# EAGLE design PCB-REMCON-E (EAGLE 7.1.0)
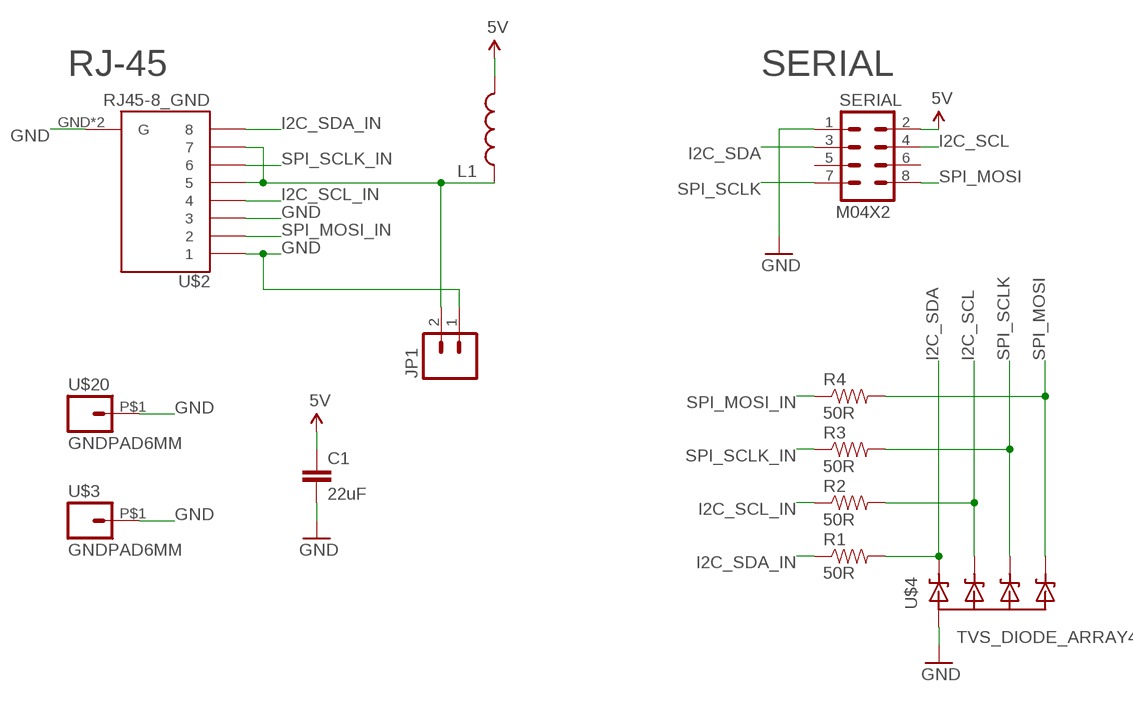
[diagram p0: schematic, sheet 1]

## Parts
C1  22uF  CAP0805  [0805]
JP1  M02PTH  [1X02]
L1  INDUCTOR0805  [0805]
R1  50R  RESISTOR0603-RES  [0603-RES]
R2  50R  RESISTOR0603-RES  [0603-RES]
R3  50R  RESISTOR0603-RES  [0603-RES]
R4  50R  RESISTOR0603-RES  [0603-RES]
SERIAL  M04X2  [2X4]
U$2  RJ45-8_GND  [RJ45-8_GND]
U$3  GNDPAD6MM  [3.2MMPAD6MM]
U$4  TVS_DIODE_ARRAY4  [SOT23-6L]
U$20  GNDPAD6MM  [3.2MMPAD6MM]

## Nets
5V [Power]: C1.1 L1.2 SERIAL.2
GND [Power]: C1.2 JP1.1 SERIAL.1 U$2.1 U$2.3 U$2.GND1(G) U$2.GND(G) U$3.P$1 U$4.2(GND) U$4.5(GND) U$20.P$1
I2C_SCL: R2.2 SERIAL.4 U$4.3(B)
I2C_SCL_IN: R2.1 U$2.4
I2C_SDA: R1.2 SERIAL.3 U$4.1(A)
I2C_SDA_IN: R1.1 U$2.8
N$1 [Power]: JP1.2 L1.1 U$2.5 U$2.7
SPI_MOSI: R4.2 SERIAL.8 U$4.6(D)
SPI_MOSI_IN: R4.1 U$2.2
SPI_SCLK: R3.2 SERIAL.7 U$4.4(C)
SPI_SCLK_IN: R3.1 U$2.6
Unconnected: SERIAL.5 SERIAL.6

## Notes on the sheet
- RJ-45 | SERIAL

## Library data of the parts
C1 = SparkFun:CAP: Capacitor Standard 0603 ceramic capacitor, and 0.1" leaded capacitor.
JP1 = SparkFun:M02: Header 2 Standard 2-pin 0.1" header. Use with straight break away headers (SKU : PRT-00116), right angle break away headers (PRT-00553), swiss pins (PRT-00743), machine pins (PRT-00117), and female headers (PRT-00115). Molex polarized connector foot print use with SKU : PRT-08233 with associated crimp pins and housings.
L1 = SparkFun:INDUCTOR: Inductors Basic Inductor/Choke - 0603 and 1206. Footprints are not proven and vary greatly between part numbers.
R1-R4 = SparkFun:RESISTOR: Resistor Basic schematic elements and footprints for 0603, 1206, and PTH resistors.
SERIAL = SparkFun:M04X2
U$2 = SKAARHOJ:RJ45-8_GND
U$3 U$20 = SKAARHOJ:GNDPAD
U$4 = SKAARHOJ:TVS_DIODE_ARRAY4

## Net classes
0 default: width 0.203 mm, drill 0.406 mm, clearance 0.203 mm
1 Power: width 0.406 mm, drill 0.61 mm, clearance 0.203 mm

## Board
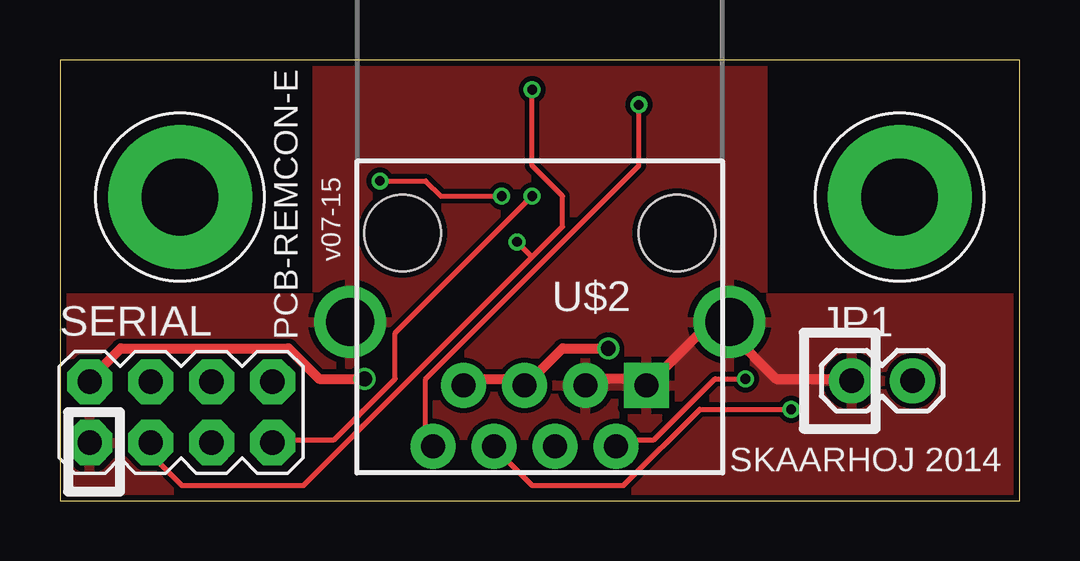
[diagram p1: board, top side]
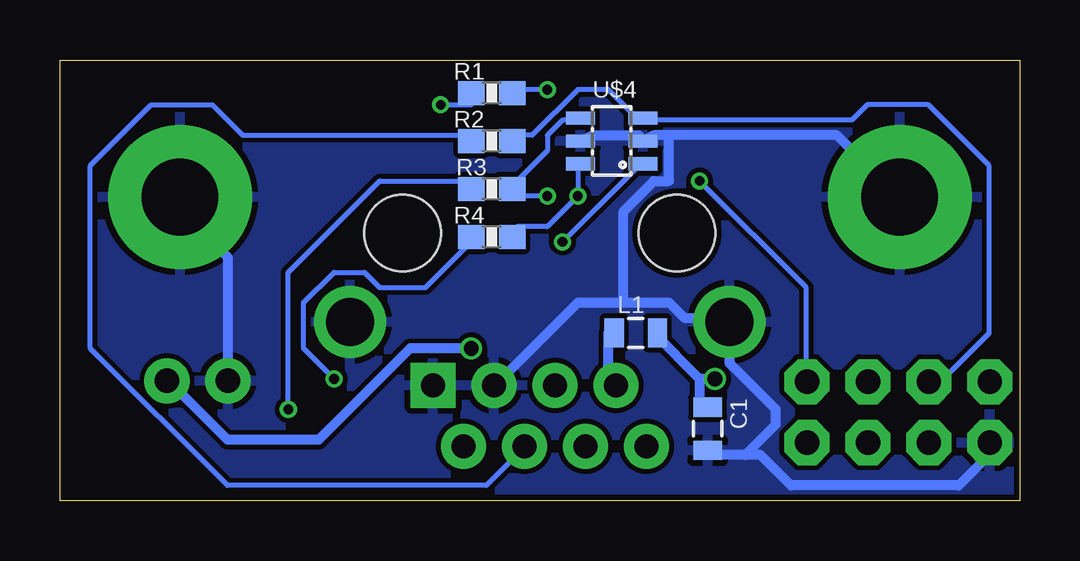
[diagram p2: board, bottom side, seen from below]

Size 40 x 18.38 mm. Coordinates in mm from the lower left corner, seen from the top.
Outline: 0,18.38 0,0 40,0 40,18.38 0,18.38
Copper layers (1*16): Top 0.035mm / dielectric 1.5mm / Bottom 0.035mm
Design rules "Fusion_eagle_rule_v1.1": minimum track width 6mil, minimum drill 12mil, track to track 6mil, track to pad 6mil, pad to pad 6mil, via to via 6mil, smd to smd 0mil, copper to edge 10mil, drill to drill 10mil, minimum pad ring 10mil, minimum via ring 6mil, stop-mask expansion 2mil, vias tented up to drill 100mil, thermal gap 10mil
tRestrict: area 29.5,8.7 to 40,19.2; area 0,8.7 to 10.5,19.2

### Footprints (pad centres in the part's own frame; a part is rotated, then mirrored left to right if it is on the bottom)
0805 = smd 0.8 x 1.2: 1 -0.9,0; 2 0.9,0
1X02 = drill 1.016 pad 1.88: 1 0,0; 2 2.54,0
0603-RES = smd 1.1 x 1: 1 -0.85,0; 2 0.85,0
2X4 = drill 1.016 pad 1.88 octagon: 1 -3.81,-1.27; 2 -3.81,1.27; 3 -1.27,-1.27; 4 -1.27,1.27; 5 1.27,-1.27; 6 1.27,1.27; 7 3.81,-1.27; 8 3.81,1.27
RJ45-8_GND = drill 1 pad 1.88 square: 1 -4.445,6.35 | drill 1 pad 1.88: 2 -3.175,8.89; 3 -1.905,6.35; 4 -0.635,8.89; 5 0.635,6.35; 6 1.905,8.89; 7 3.175,6.35; 8 4.445,8.89 | drill 2: GND -7.9,3.7; GND1 7.9,3.7 | hole 3.2: -5.715,0; 5.715,0
3.2MMPAD6MM = drill 3.2 pad 6: P$1 0,0
SOT23-6L = smd 0.55 x 1.2: 1 -0.95,-1.3; 2 0,-1.3; 3 0.95,-1.3; 4 0.95,1.3; 5 0,1.3; 6 -0.95,1.3

### Placement (x,y rotation side)
C1  13,3 270 bottom
JP1  33,5 0 top
L1  16,7 0 bottom
R1  22,17 0 bottom
R2  22,15 0 bottom
R3  22,13 0 bottom
R4  22,11 0 bottom
SERIAL  5.05,3.69 0 top
U$2  20,11.16 180 top
U$3  35,12.66 0 top
U$4  17,15 90 bottom
U$20  5,12.66 0 top

### Tracks (layer width: path | path; a pad name or v marks a point on that pad's centre or on a via)
5V  (via drill 0.61)
  Top 0.406: v12.7,5.08 10.79,5.08 9.53,6.35 2.54,6.35 1.27,5.08 SERIAL.2
  Bottom 0.406: 13.34,5.08 13.34,3.81 C1.1 | 13.34,5.08 15.24,6.99 L1.2 | v12.7,5.08 13.34,5.08
GND
  Top 0.406: U$2.3 22.23,5.08 24.13,5.08 U$2.1 24.77,5.08 27.3,7.62 U$2.GND 27.94,6.99 29.84,5.08 32.38,5.08 JP1.1
  Bottom 0.406: U$4.5 17.78,15.24 15.88,15.24 U$4.2 15.24,15.24 14.61,15.24 | 14.61,15.24 7.62,15.24 5.08,12.7 U$20.P$1 | 11.43,1.91 10.79,1.91 9.53,0.64 2.54,0.64 1.27,1.91 SERIAL.1 | 11.43,1.91 12.7,1.91 C1.2 | 11.43,1.91 10.16,3.17 10.16,3.81 12.06,5.71 12.06,6.99 U$2.GND1 12.7,7.62 13.97,7.62 14.61,8.26 16.51,8.26 | JP1.1 33.02,5.08 33.02,10.16 34.92,12.06 U$3.P$1 | 16.51,8.26 18.41,8.26 21.59,5.08 U$2.3 | 14.61,15.24 14.61,13.34 15.24,13.34 16.51,12.06 16.51,8.26
  pour Top: 0,0 40,0 40,19 0,19
  pour Bottom: 0,0 40,0 40,19 0,19
I2C_SCL
  Bottom 0.203: R2.2 20.95,15.24 20.32,15.24 18.41,17.14 17.14,17.14 15.88,15.88 U$4.3 15.24,15.88 6.99,15.88 6.35,16.51 3.81,16.51 1.27,13.97 1.27,6.99 3.17,5.08 SERIAL.4
I2C_SCL_IN
  Bottom 0.203: R2.1 22.86,15.24 32.38,15.24 33.66,16.51 36.2,16.51 38.73,13.97 38.73,6.35 33.02,0.64 22.23,0.64 20.95,1.91 U$2.4
I2C_SDA  (via drill 0.41)
  Top 0.203: v19.68,17.14 19.68,13.97 20.95,12.7 20.95,11.43 19.68,10.16 | 19.68,10.16 10.16,0.64 5.08,0.64 3.81,1.91 SERIAL.3 | 19.68,10.16 v19.05,10.79
  Bottom 0.203: v19.68,17.14 20.95,17.14 R1.2 | v19.05,10.79 15.88,13.97 U$4.1
I2C_SDA_IN  (via drill 0.41)
  Top 0.203: v24.13,16.51 24.13,13.97 15.24,5.08 15.24,2.54 U$2.8
  Bottom 0.203: v24.13,16.51 22.86,16.51 R1.1
N$1  (via drill 0.61)
  Top 0.406: U$2.7 17.14,5.08 19.05,5.08 U$2.5 19.68,5.08 20.95,6.35 v22.86,6.35
  Bottom 0.406: L1.1 17.14,6.99 17.14,5.08 U$2.7 | v22.86,6.35 25.4,6.35 29.21,2.54 33.02,2.54 34.92,4.45 JP1.2
SPI_MOSI  (via drill 0.41)
  Top 0.203: v18.41,12.7 15.88,12.7 15.24,13.34 v13.34,13.34
  Bottom 0.203: R4.2 20.95,11.43 19.68,11.43 v18.41,12.7 18.41,13.97 U$4.6 | v13.34,13.34 8.89,8.89 8.89,5.08 SERIAL.8
SPI_MOSI_IN  (via drill 0.41)
  Top 0.203: v28.57,5.08 27.3,5.08 24.77,2.54 23.5,2.54 U$2.2
  Bottom 0.203: v28.57,5.08 29.84,6.35 29.84,8.26 28.57,9.53 27.3,9.53 26.67,8.89 24.77,8.89 22.86,10.79 R4.1
SPI_SCLK  (via drill 0.41)
  Top 0.203: v19.68,12.7 13.97,6.99 13.97,5.08 11.43,2.54 8.89,2.54 SERIAL.7
  Bottom 0.203: U$4.4 18.41,15.88 19.05,15.88 19.68,15.24 19.68,14.61 20.95,13.34 R3.2 20.95,12.7 v19.68,12.7
SPI_SCLK_IN  (via drill 0.41)
  Top 0.203: v30.48,3.81 26.67,3.81 23.5,0.64 19.68,0.64 18.41,1.91 U$2.6
  Bottom 0.203: v30.48,3.81 30.48,9.53 26.67,13.34 22.86,13.34 R3.1

### Text on the board
_tsilk: v07-15 | PCB-REMCON-E | SKAARHOJ 2014